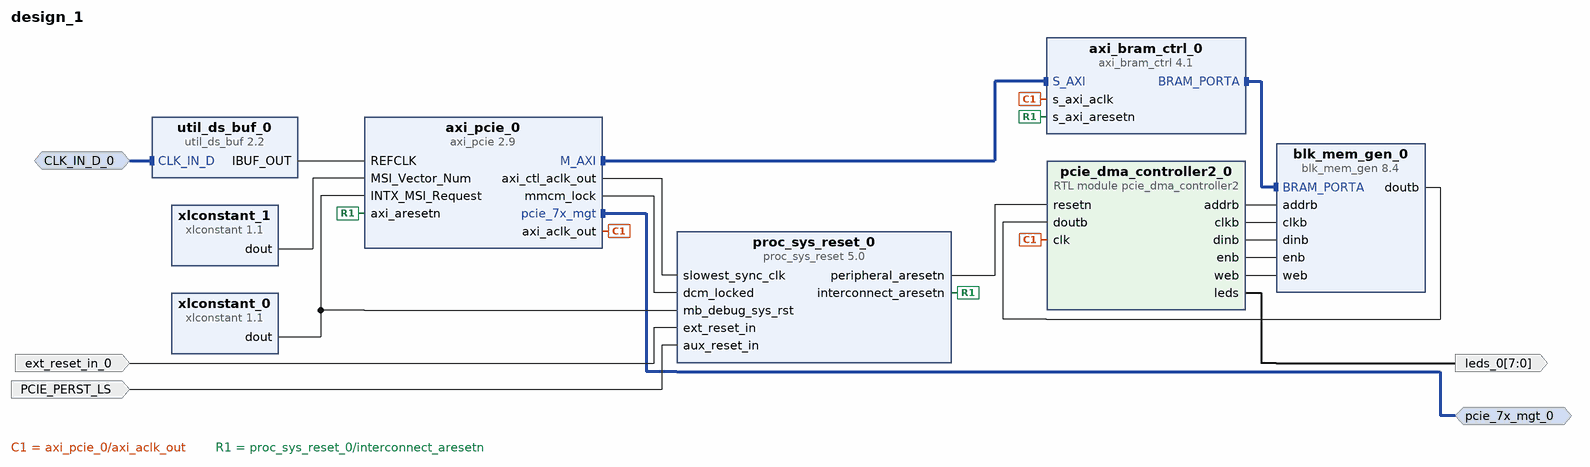
[diagram p0: block diagram of the top level]
# Vivado block design design_1, xc7k325tffg900-2, Vivado 2021.2
create_bd_design design_1

create_bd_intf_port -mode Master -vlnv xilinx.com:interface:pcie_7x_mgt_rtl:1.0 pcie_7x_mgt_0
create_bd_intf_port -mode Slave -vlnv xilinx.com:interface:diff_clock_rtl:1.0 CLK_IN_D_0
create_bd_port -dir I -type rst PCIE_PERST_LS
set_property -dict {CONFIG.POLARITY ACTIVE_LOW} [get_bd_ports PCIE_PERST_LS]
create_bd_port -dir O -from 7 -to 0 leds_0
create_bd_port -dir I -type rst ext_reset_in_0

create_bd_cell -type ip -vlnv xilinx.com:ip:blk_mem_gen:8.4 blk_mem_gen_0
set_property -dict [list \
  CONFIG.Assume_Synchronous_Clk true \
  CONFIG.Byte_Size 8 \
  CONFIG.Enable_32bit_Address false \
  CONFIG.Enable_B Use_ENB_Pin \
  CONFIG.Memory_Type True_Dual_Port_RAM \
  CONFIG.Port_B_Clock 100 \
  CONFIG.Port_B_Enable_Rate 100 \
  CONFIG.Port_B_Write_Rate 50 \
  CONFIG.Read_Width_A 128 \
  CONFIG.Read_Width_B 512 \
  CONFIG.Register_PortA_Output_of_Memory_Primitives false \
  CONFIG.Register_PortB_Output_of_Memory_Primitives false \
  CONFIG.Use_Byte_Write_Enable true \
  CONFIG.Use_RSTA_Pin false \
  CONFIG.Use_RSTB_Pin false \
  CONFIG.Write_Depth_A 32 \
  CONFIG.Write_Width_A 128 \
  CONFIG.Write_Width_B 512 \
  CONFIG.use_bram_block Stand_Alone \
] [get_bd_cells blk_mem_gen_0]
create_bd_cell -type ip -vlnv xilinx.com:ip:axi_bram_ctrl:4.1 axi_bram_ctrl_0
set_property -dict {CONFIG.DATA_WIDTH 128 CONFIG.SINGLE_PORT_BRAM 1 CONFIG.SUPPORTS_NARROW_BURST 1} [get_bd_cells axi_bram_ctrl_0]
create_bd_cell -type ip -vlnv xilinx.com:ip:axi_pcie:2.9 axi_pcie_0
set_property -dict [list \
  CONFIG.AXIBAR2PCIEBAR_0 0x0 \
  CONFIG.AXIBAR_AS_0 true \
  CONFIG.BAR0_SIZE 64 \
  CONFIG.BAR_64BIT true \
  CONFIG.DEVICE_ID 0x7018 \
  CONFIG.ENABLE_CLASS_CODE false \
  CONFIG.MAX_LINK_SPEED 2.5_GT/s \
  CONFIG.M_AXI_DATA_WIDTH 128 \
  CONFIG.NO_OF_LANES X8 \
  CONFIG.NUM_MSI_REQ 0 \
  CONFIG.S_AXI_DATA_WIDTH 128 \
  CONFIG.XLNX_REF_BOARD KC705_REVC \
] [get_bd_cells axi_pcie_0]
create_bd_cell -type ip -vlnv xilinx.com:ip:proc_sys_reset:5.0 proc_sys_reset_0
set_property -dict [list \
  CONFIG.C_AUX_RESET_HIGH 0 \
  CONFIG.C_AUX_RST_WIDTH 16 \
  CONFIG.RESET_BOARD_INTERFACE reset \
  CONFIG.USE_BOARD_FLOW true \
] [get_bd_cells proc_sys_reset_0]
create_bd_cell -type ip -vlnv xilinx.com:ip:xlconstant:1.1 xlconstant_0
set_property -dict {CONFIG.CONST_VAL 0} [get_bd_cells xlconstant_0]
create_bd_cell -type ip -vlnv xilinx.com:ip:xlconstant:1.1 xlconstant_1
set_property -dict {CONFIG.CONST_VAL 0b00000 CONFIG.CONST_WIDTH 5} [get_bd_cells xlconstant_1]
create_bd_cell -type module -reference pcie_dma_controller2 pcie_dma_controller2_0
create_bd_cell -type ip -vlnv xilinx.com:ip:util_ds_buf:2.2 util_ds_buf_0
set_property -dict {CONFIG.DIFF_CLK_IN_BOARD_INTERFACE pcie_refclk} [get_bd_cells util_ds_buf_0]

# ---- connections ----

connect_bd_intf_net -intf_net CLK_IN_D_0_1 [get_bd_intf_ports CLK_IN_D_0] [get_bd_intf_pins util_ds_buf_0/CLK_IN_D]
connect_bd_intf_net [get_bd_intf_pins axi_bram_ctrl_0/BRAM_PORTA] [get_bd_intf_pins blk_mem_gen_0/BRAM_PORTA]
connect_bd_intf_net [get_bd_intf_pins axi_pcie_0/M_AXI] [get_bd_intf_pins axi_bram_ctrl_0/S_AXI]
connect_bd_intf_net [get_bd_intf_ports pcie_7x_mgt_0] [get_bd_intf_pins axi_pcie_0/pcie_7x_mgt]
connect_bd_net [get_bd_pins axi_pcie_0/axi_ctl_aclk_out] [get_bd_pins proc_sys_reset_0/slowest_sync_clk]
connect_bd_net [get_bd_pins axi_pcie_0/mmcm_lock] [get_bd_pins proc_sys_reset_0/dcm_locked]
connect_bd_net [get_bd_pins blk_mem_gen_0/doutb] [get_bd_pins pcie_dma_controller2_0/doutb]
connect_bd_net -net clk_wiz_0_clk_out1 [get_bd_pins axi_pcie_0/axi_aclk_out] \
  [get_bd_pins axi_bram_ctrl_0/s_axi_aclk] [get_bd_pins pcie_dma_controller2_0/clk]
connect_bd_net -net ext_reset_in_0_1 [get_bd_ports ext_reset_in_0] [get_bd_pins proc_sys_reset_0/ext_reset_in]
connect_bd_net [get_bd_pins pcie_dma_controller2_0/addrb] [get_bd_pins blk_mem_gen_0/addrb]
connect_bd_net [get_bd_pins pcie_dma_controller2_0/clkb] [get_bd_pins blk_mem_gen_0/clkb]
connect_bd_net [get_bd_pins pcie_dma_controller2_0/dinb] [get_bd_pins blk_mem_gen_0/dinb]
connect_bd_net [get_bd_pins pcie_dma_controller2_0/enb] [get_bd_pins blk_mem_gen_0/enb]
connect_bd_net [get_bd_pins pcie_dma_controller2_0/leds] [get_bd_ports leds_0]
connect_bd_net [get_bd_pins pcie_dma_controller2_0/web] [get_bd_pins blk_mem_gen_0/web]
connect_bd_net [get_bd_pins proc_sys_reset_0/interconnect_aresetn] [get_bd_pins axi_pcie_0/axi_aresetn] [get_bd_pins axi_bram_ctrl_0/s_axi_aresetn]
connect_bd_net [get_bd_pins proc_sys_reset_0/peripheral_aresetn] [get_bd_pins pcie_dma_controller2_0/resetn]
connect_bd_net [get_bd_pins util_ds_buf_0/IBUF_OUT] [get_bd_pins axi_pcie_0/REFCLK]
connect_bd_net -net util_vector_logic_0_Res [get_bd_ports PCIE_PERST_LS] [get_bd_pins proc_sys_reset_0/aux_reset_in]
connect_bd_net [get_bd_pins xlconstant_0/dout] [get_bd_pins proc_sys_reset_0/mb_debug_sys_rst] [get_bd_pins axi_pcie_0/INTX_MSI_Request]
connect_bd_net [get_bd_pins xlconstant_1/dout] [get_bd_pins axi_pcie_0/MSI_Vector_Num]

# ---- address map ----
assign_bd_address -offset 0xC0000000 -range 16K -target_address_space [get_bd_addr_spaces axi_pcie_0/M_AXI] [get_bd_addr_segs axi_bram_ctrl_0/S_AXI/Mem0]

validate_bd_design
save_bd_design
